# EAGLE design quad2 (EAGLE 7.5.0)
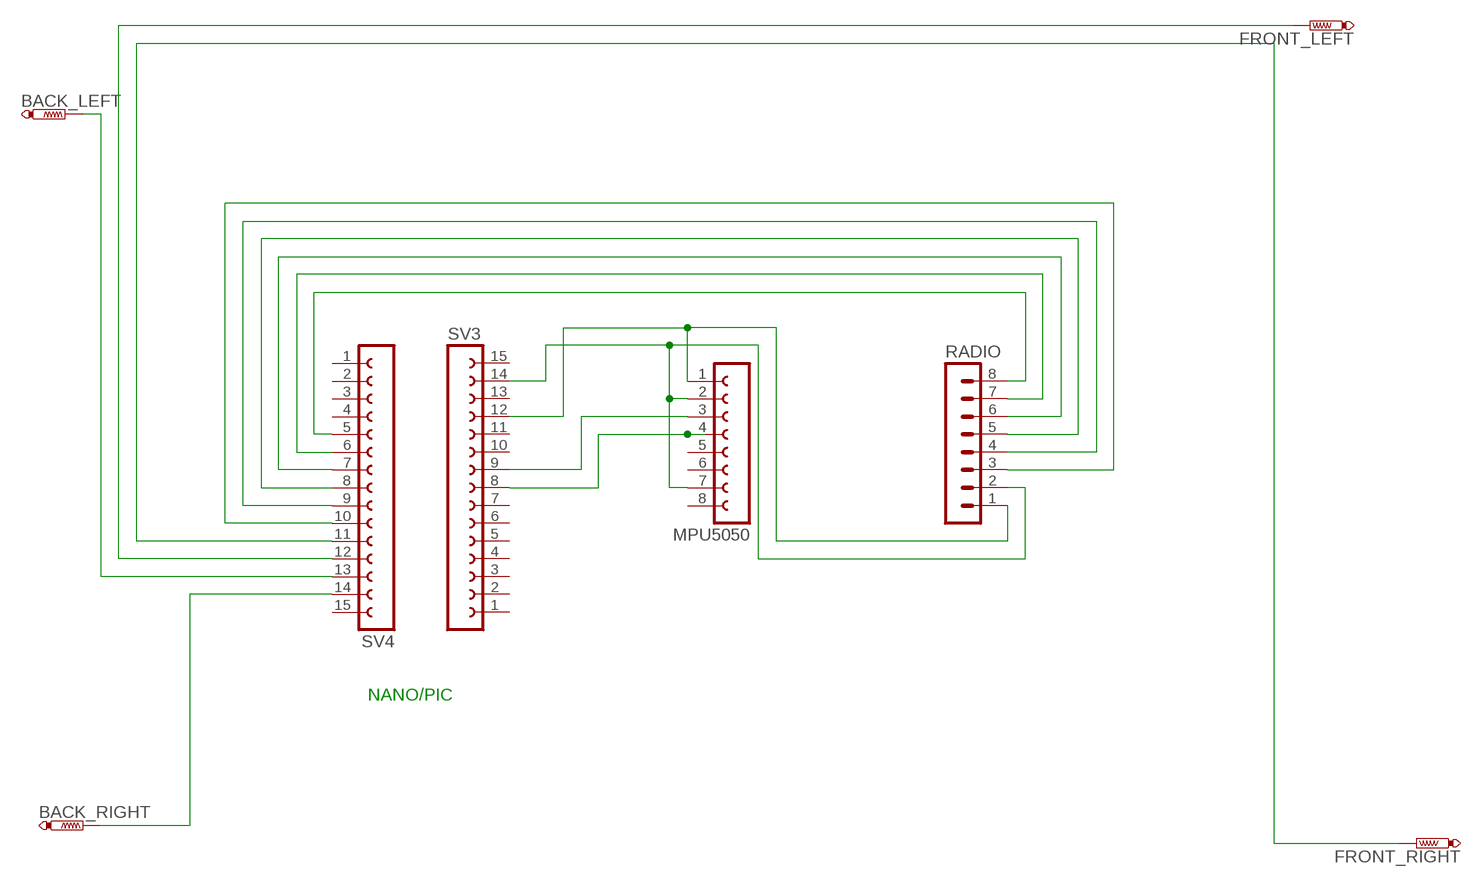
[diagram p0: schematic, sheet 1]

## Parts
BACK_LEFT  PTR1PAD1-13Y  [P1-13Y]
BACK_RIGHT  PTR1PAD1-13Y  [P1-13Y]
FRONT_LEFT  PTR1PAD1-13Y  [P1-13Y]
FRONT_RIGHT  PTR1PAD1-13Y  [P1-13Y]
MPU5050  FE08-1  [FE08]
RADIO  MA08-1  [MA08-1]
SV3  FE15-1  [FE15]
SV4  FE15-1  [FE15]

## Nets
N$1: MPU5050.1 RADIO.1 SV3.12
N$2: RADIO.4 SV4.9
N$3: MPU5050.2 MPU5050.7 RADIO.2 SV3.14
N$4: RADIO.5 SV4.8
N$5: MPU5050.3 SV3.9
N$6: MPU5050.4 SV3.8
N$7: RADIO.6 SV4.7
N$8: RADIO.3 SV4.10
N$9: RADIO.7 SV4.6
N$10: RADIO.8 SV4.5
N$11: BACK_RIGHT.TP SV4.14
N$12: BACK_LEFT.TP SV4.13
N$13: FRONT_LEFT.TP SV4.12
N$14: FRONT_RIGHT.TP SV4.11
Unconnected: MPU5050.5 MPU5050.6 MPU5050.8 SV3.1 SV3.2 SV3.3 SV3.4 SV3.5 SV3.6 SV3.7 SV3.10 SV3.11 SV3.13 SV3.15 SV4.1 SV4.2 SV4.3 SV4.4 SV4.15

## Notes on the sheet
- NANO/PIC

## Library data of the parts
BACK_LEFT BACK_RIGHT FRONT_LEFT FRONT_RIGHT = testpad:PTR1: TEST PIN
MPU5050 = con-lsta:FE08-1: FEMALE HEADER; OC_FARNELL: unknown; OC_NEWARK: unknown
RADIO = con-lstb:MA08-1: PIN HEADER; OC_FARNELL: unknown; OC_NEWARK: unknown
SV3 SV4 = con-lsta:FE15-1: FEMALE HEADER; OC_FARNELL: unknown; OC_NEWARK: unknown

## Board
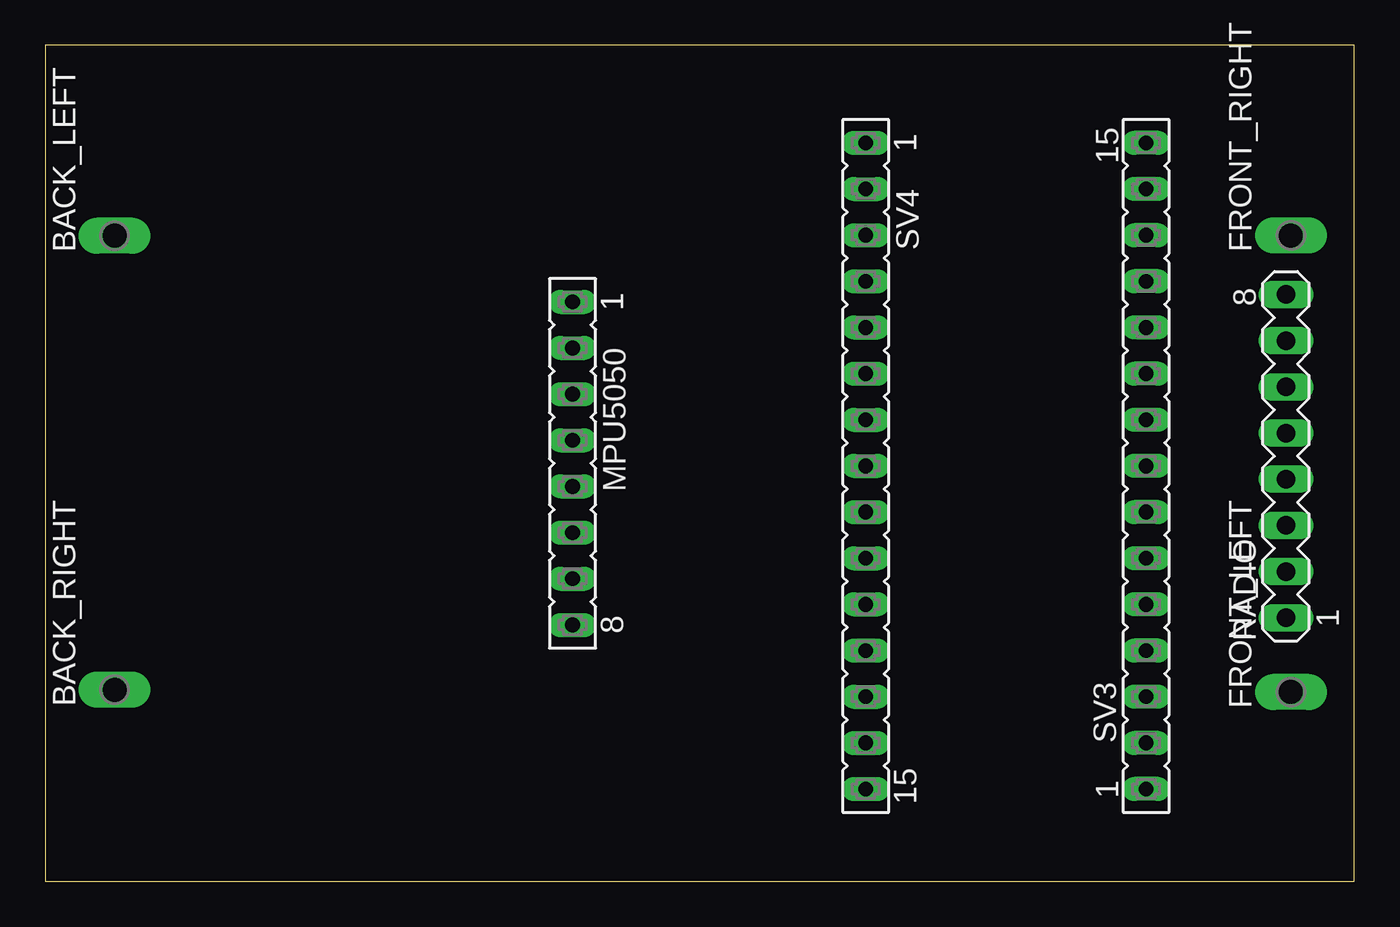
[diagram p1: board, top side]
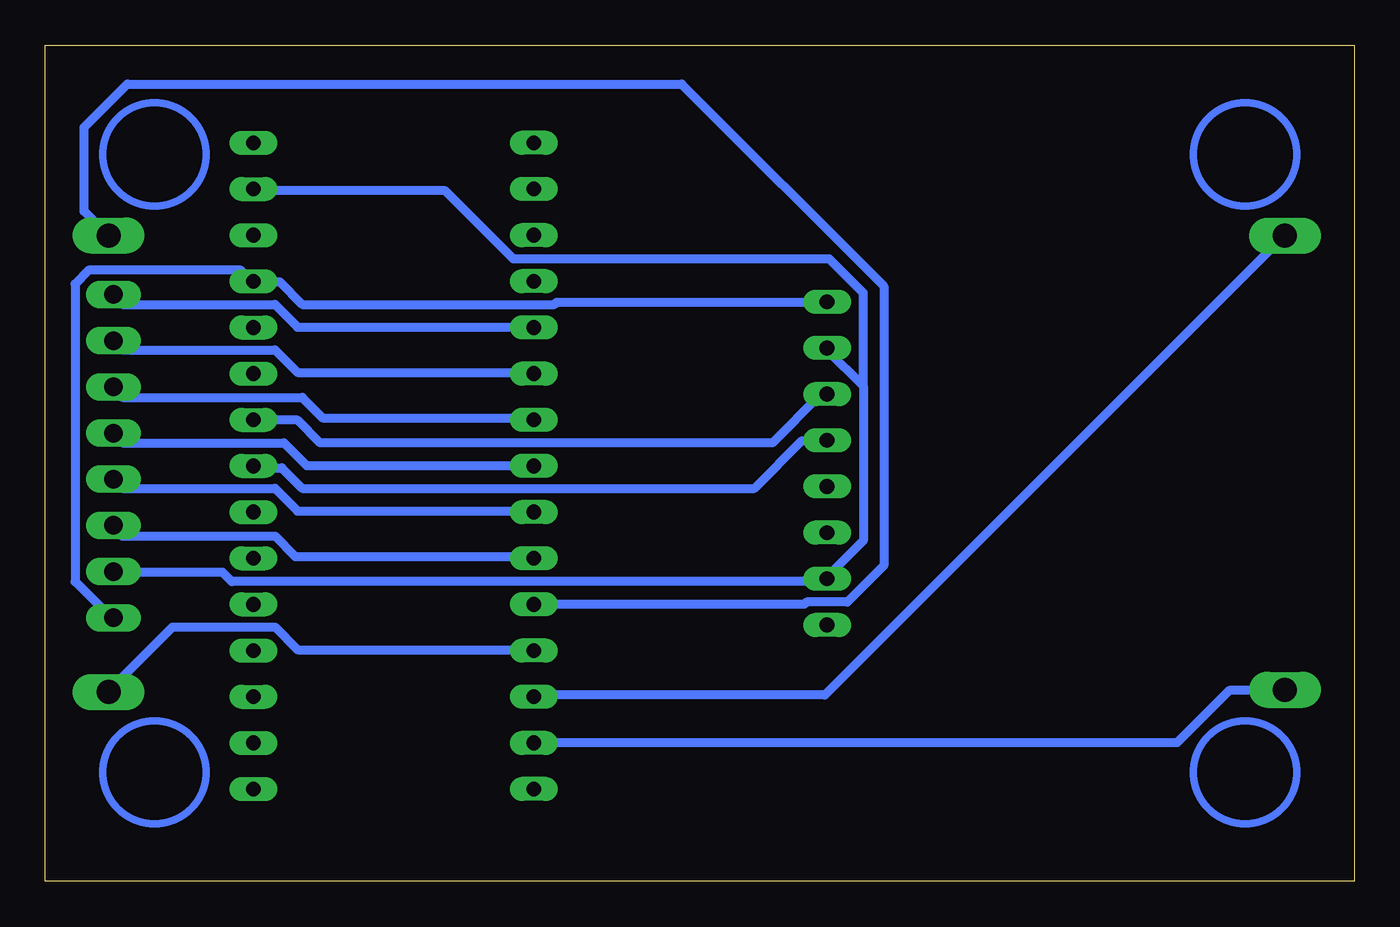
[diagram p2: board, bottom side, seen from below]

Size 72 x 46 mm. Coordinates in mm from the lower left corner, seen from the top.
Outline: 0,0 72,0 72,46 0,46 0,0
Copper layers (1*16): Top 0.035mm / dielectric 1.5mm / Bottom 0.035mm
Design rules "default *": minimum track width 20mil, minimum drill 24mil, track to track 20mil, track to pad 12mil, pad to pad 8mil, via to via 8mil, smd to smd 8mil, copper to edge 40mil, drill to drill 8mil, minimum pad ring 10mil, minimum via ring 8mil, stop-mask expansion 4mil, vias tented up to drill 0mil, thermal gap 10mil

### Footprints (pad centres in the part's own frame; a part is rotated, then mirrored left to right if it is on the bottom)
P1-13Y = drill 1.321 pad 1.905 long: TP 0,0
FE08 = drill 0.813 long: 1 -8.89,0; 2 -6.35,0; 3 -3.81,0; 4 -1.27,0; 5 1.27,0; 6 3.81,0; 7 6.35,0; 8 8.89,0
MA08-1 = drill 1.016 long: 1 -8.89,0; 2 -6.35,0; 3 -3.81,0; 4 -1.27,0; 5 1.27,0; 6 3.81,0; 7 6.35,0; 8 8.89,0
FE15 = drill 0.813 long: 1 -17.78,0; 2 -15.24,0; 3 -12.7,0; 4 -10.16,0; 5 -7.62,0; 6 -5.08,0; 7 -2.54,0; 8 0,0; 9 2.54,0; 10 5.08,0; 11 7.62,0; 12 10.16,0; 13 12.7,0; 14 15.24,0; 15 17.78,0

### Placement (x,y rotation side)
BACK_LEFT  3.81,35.53 90 top
BACK_RIGHT  3.81,10.54 90 top
FRONT_LEFT  68.52,10.42 90 top
FRONT_RIGHT  68.52,35.54 90 top
MPU5050  29,23 270 top
RADIO  68.25,23.4 90 top
SV3  60.56,22.86 90 top
SV4  45.13,22.86 270 top

### Tracks (layer width: path | path; a pad name or v marks a point on that pad's centre or on a via)
N$1
  Bottom 0.508: MPU5050.1 29,31.88 43.88,31.88 44,31.75 57.88,31.75 59.12,33 60.5,33 SV3.12 60.75,33.12 61.25,33.62 69.62,33.62 70.38,32.88 70.38,16.5 68.5,14.62 68.25,14.62 RADIO.1
N$2
  Bottom 0.508: SV4.9 45.25,20.38 58.12,20.38 59.38,21.62 67.75,21.62 RADIO.4
N$3
  Bottom 0.508: 27,27.25 27,18.75 29,16.75 MPU5050.7 29.12,16.5 61.75,16.5 62.25,17 68.25,17 RADIO.2 | 27,27.25 29,29.25 MPU5050.2 | 27,27.25 27,32.38 28.88,34.25 46.25,34.25 50,38 60.5,38 SV3.14
N$4
  Bottom 0.508: SV4.8 45.25,22.88 57.62,22.88 58.88,24.12 67.75,24.12 68.25,24.62 RADIO.5
N$5
  Bottom 0.508: SV3.9 60.5,25.38 58.12,25.38 56.88,24.12 32,24.12 29.38,26.75 29,26.75 MPU5050.3
N$6
  Bottom 0.508: MPU5050.4 29,24.25 30.38,24.25 33,21.62 57.88,21.62 59,22.75 60.5,22.75 SV3.8
N$7
  Bottom 0.508: SV4.7 45.25,25.5 56.75,25.5 57.88,26.62 67.75,26.62 68.25,27.12 RADIO.6
N$8
  Bottom 0.508: SV4.10 45.25,17.88 58.25,17.88 59.38,19 67.75,19 68.25,19.5 RADIO.3
N$9
  Bottom 0.508: RADIO.7 67.75,29.25 59.38,29.25 58.12,28 45.25,28 SV4.6
N$10
  Bottom 0.508: SV4.5 45.25,30.5 58.12,30.5 59.38,31.75 67.75,31.75 68.25,32.25 RADIO.8
N$11
  Bottom 0.508: SV4.14 9.75,7.62 6.88,10.5 3.88,10.5 BACK_RIGHT.TP
N$12
  Bottom 0.508: SV4.13 45.12,10.25 29.12,10.25 3.88,35.5 BACK_LEFT.TP
N$13
  Bottom 0.508: SV4.12 45.25,12.75 58.12,12.75 59.38,14 65,14 68.5,10.5 FRONT_LEFT.TP
N$14
  Bottom 0.508: SV4.11 30.25,15.25 30.12,15.38 27.88,15.38 25.88,17.38 25.88,32.75 37,43.88 67.5,43.88 69.88,41.5 69.88,36.88 68.62,35.62 FRONT_RIGHT.TP
(copper drawn outside any net)
  shapes: Bottom circle x4